# EAGLE schematic esp32-acv-v10 (EAGLE 6.1)
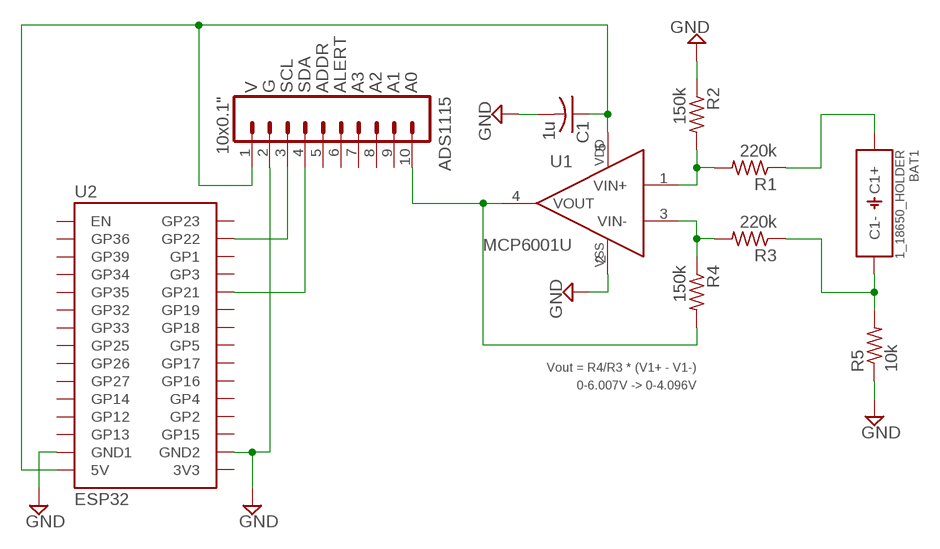
[diagram p0: schematic, sheet 1]

## Parts
ADS1115  10x0.1"  M10"  [1X10]
BAT1  1_18650_HOLDER  [1S_18650_SMD_NH]
C1  1u  C-USC0402  [C0402]
R1  220k  R-US_R0402  [R0402]
R2  150k  R-US_R0402  [R0402]
R3  220k  R-US_R0402  [R0402]
R4  150k  R-US_R0402  [R0402]
R5  10k  R-US_R0402  [R0402]
U1  MCP6001U  [SOT23-5]
U2  ESP32  [ESP32-30P]

## Nets
5V: ADS1115.1 C1.1 U1.5(VDD) U2.30(5V)
C1V: ADS1115.10 R4.2 U1.4(VOUT)
GND: ADS1115.2 C1.2 R2.1 R5.1 U1.2(VSS) U2.2(GND2) U2.29(GND1)
N$1: BAT1.1+(C1+) R1.1
N$3: R1.2 R2.2 U1.1(VIN+)
N$4: R3.2 R4.1 U1.3(VIN-)
N$5: BAT1.1-(C1-) R3.1 R5.2
N$7: ADS1115.3 U2.14(GP22)
N$8: ADS1115.4 U2.11(GP21)
Unconnected: ADS1115.5 ADS1115.6 ADS1115.7 ADS1115.8 ADS1115.9 U2.1(3V3) U2.3(GP15) U2.4(GP2) U2.5(GP4) U2.6(GP16) U2.7(GP17) U2.8(GP5) U2.9(GP18) U2.10(GP19) U2.12(GP3) U2.13(GP1) U2.15(GP23) U2.16(EN) U2.17(GP36) U2.18(GP39) U2.19(GP34) U2.20(GP35) U2.21(GP32) U2.22(GP33) U2.23(GP25) U2.24(GP26) U2.25(GP27) U2.26(GP14) U2.27(GP12) U2.28(GP13)

## Notes on the sheet
- V | G | SCL | SDA | ADDR | ALERT | A3 | A2 | A1 | A0
- Vout = R4/R3 * (V1+ - V1-)
- 0-6.007V -> 0-4.096V

## Library data of the parts
ADS1115 = SparkFun:M10: Header 10 Standard 10-pin 0.1" header. Use with straight break away headers (SKU : PRT-00116), right angle break away headers (PRT-00553), swiss pins (PRT-00743), machine pins (PRT-00117), and female headers (PRT-00115).
BAT1 = custom:1_18650_HOLDER
C1 = resistor:C-US: CAPACITOR, American symbol
R1-R5 = resistor:R-US_: RESISTOR, American symbol
U1 = custom:MCP6001: Op-Amp Single Rail-to-Rail 1MHz
U2 = custom:ESP32